# Altium schematic sheet FMC_DIO_32ch_lvds_a.SchDoc: FMC DIO LVDS 32
size 420 x 297 mm; Projet: FMC LVDS 32; CheckedBy: MK; Author: G.K.; CompanyName: CREOTECH; DrawnBy: G.K.; Organization: CTI SA; Address1: Creotech Instruments SA; Address2: Okulickiego 7/9, 05-500 Poland; DocumentNumber: 27; Revision: -; SheetNumber: 27; SheetTotal: 29; ModifiedBy: -; CreateDate: XX/XX/XXXX; CheckedDate: -; Title2: top; DivGrp: CTI; Designer: G.K.; ModifiedDate: -; ProjectName: FMC LVDS 32
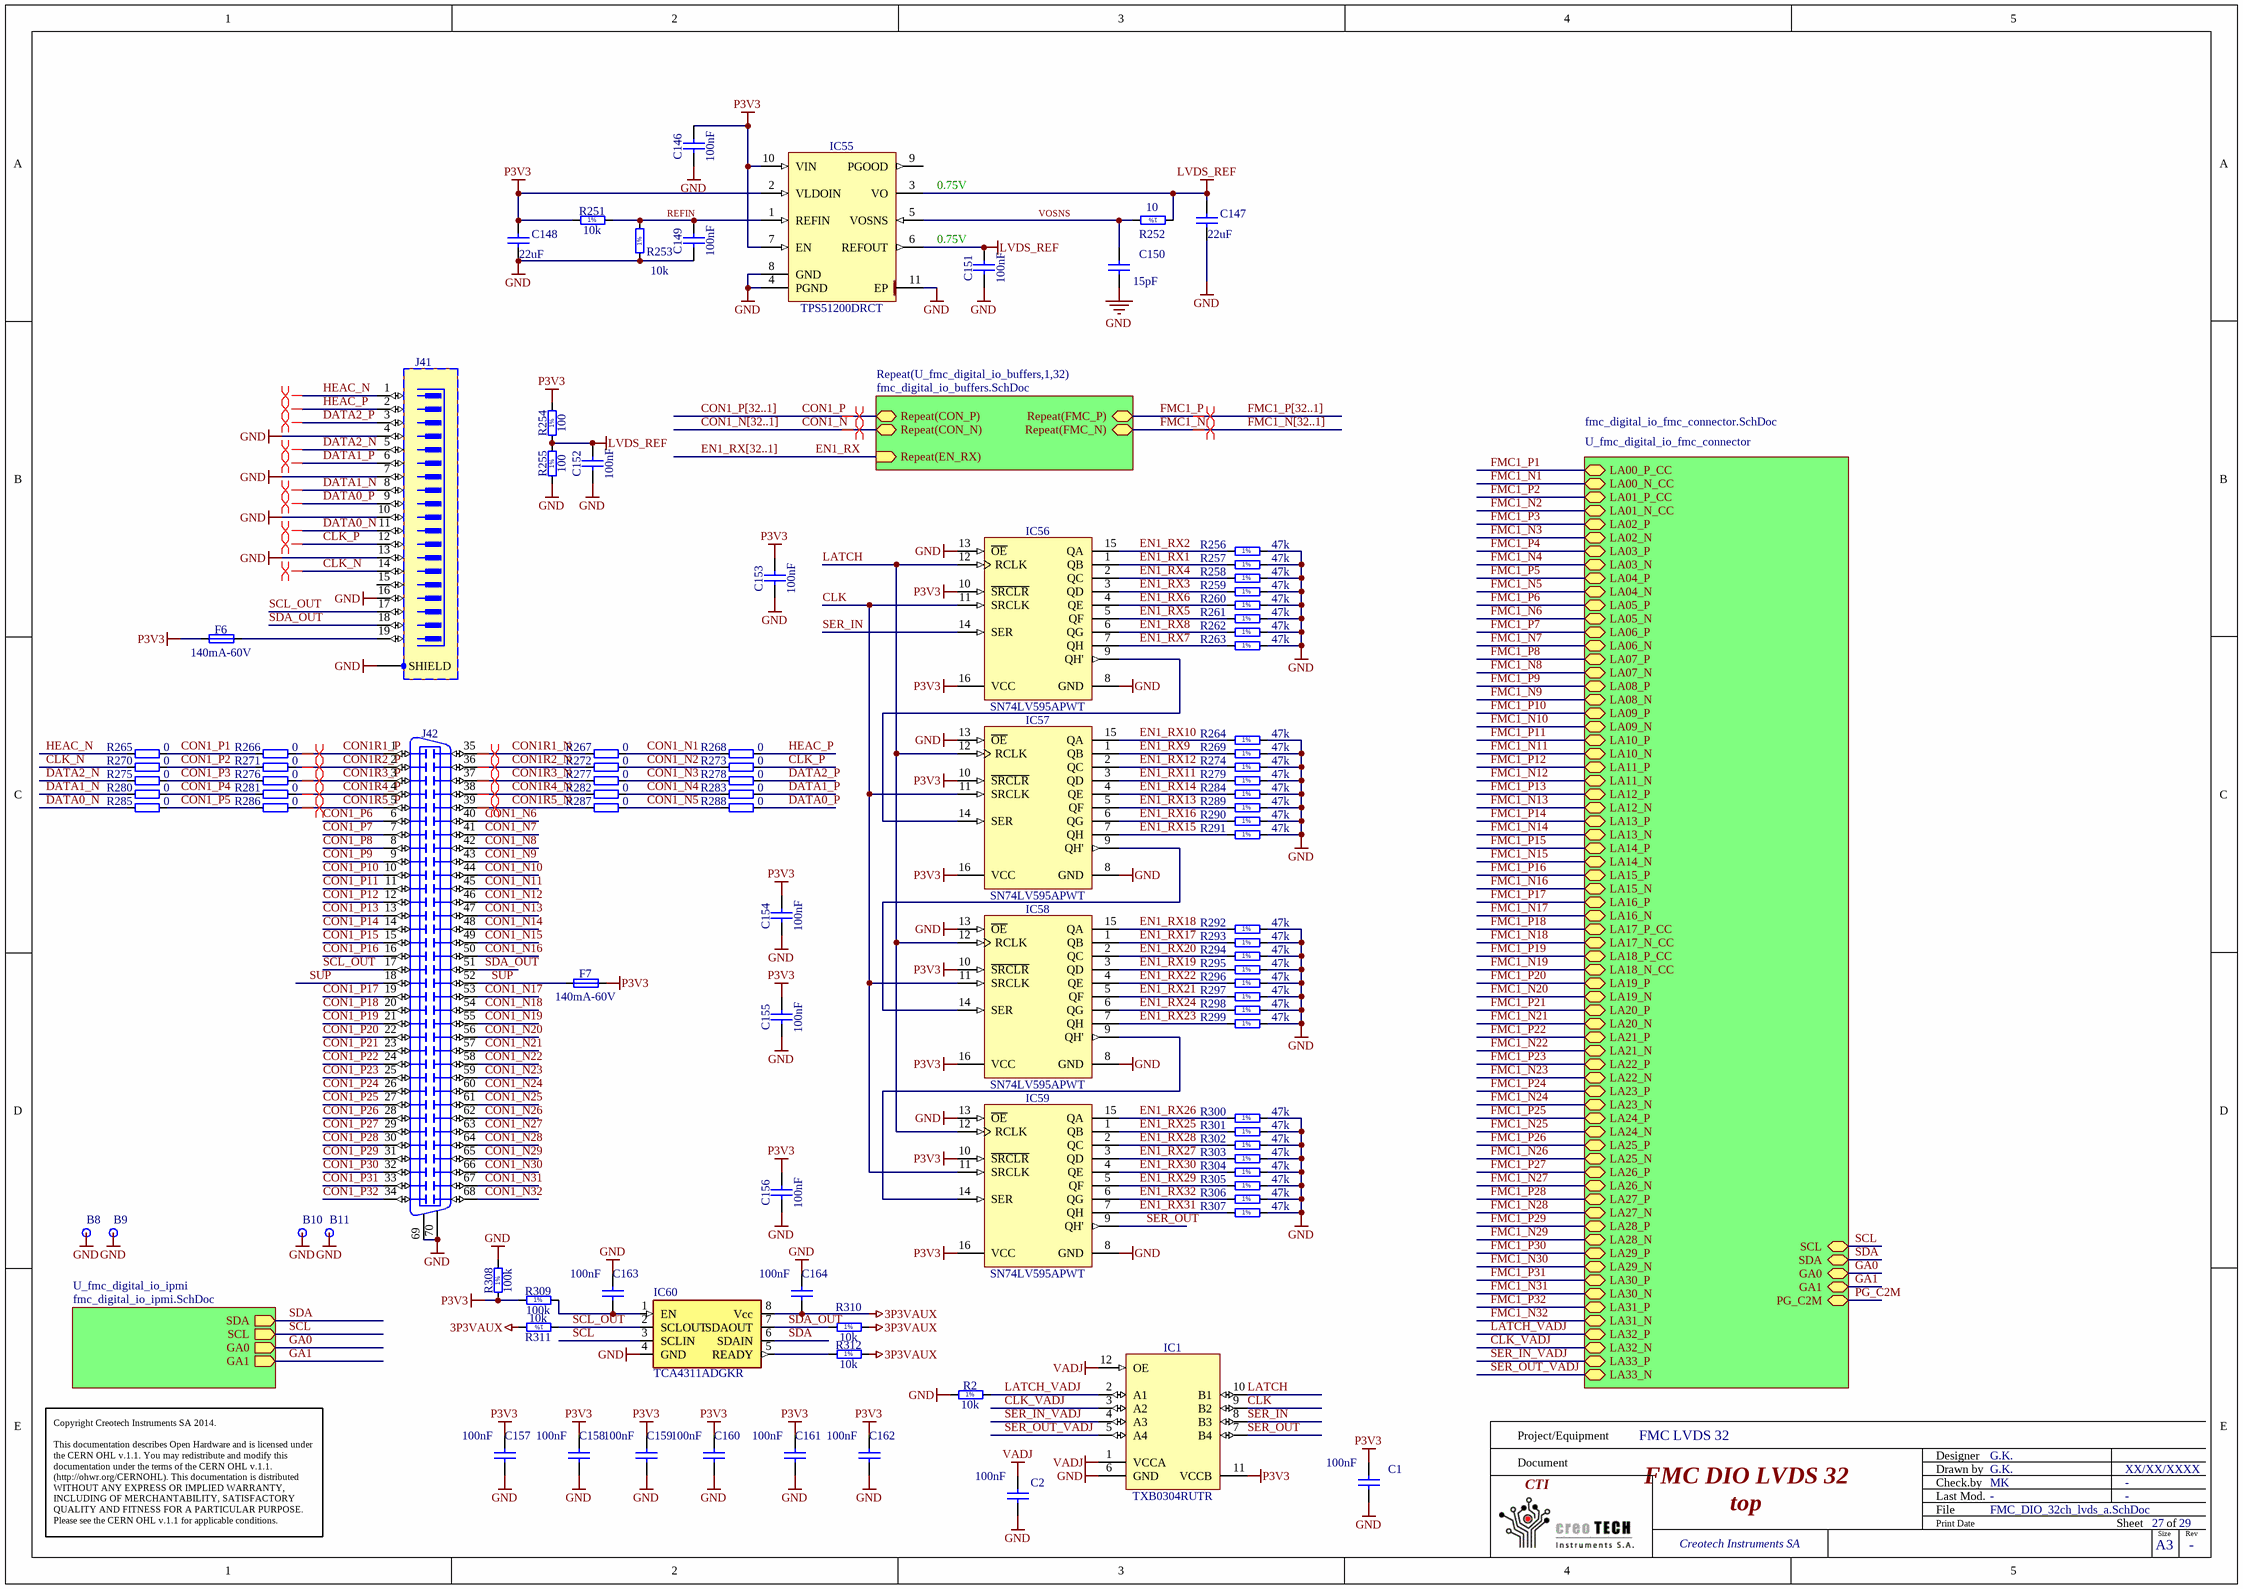
[diagram p0: FMC_DIO_32ch_lvds_a.SchDoc]

## Parts
B8  Plated Hole  [MTG300_600]  (value not drawn)
B9  Plated Hole  [MTG300_600]  (value not drawn)
B10  Plated Hole  [MTG300_600]  (value not drawn)
B11  Plated Hole  [MTG300_600]  (value not drawn)
C1  100nF  [CAPC1005X55N]
C2  100nF  [CAPC1005X55N]
C146  100nF  [CAPC1005X55N]
C147  22uF  [CAPC3216X180N]
C148  22uF  [CAPC3216X180N]
C149  100nF  [CAPC1005X55N]
C150  15pF  [CAPC1005X55N]
C151  100nF  [CAPC1005X55N]
C152  100nF  [CAPC1005X55N]
C153  100nF  [CAPC1005X55N]
C154  100nF  [CAPC1005X55N]
C155  100nF  [CAPC1005X55N]
C156  100nF  [CAPC1005X55N]
C157  100nF  [CAPC1005X55N]
C158  100nF  [CAPC1005X55N]
C159  100nF  [CAPC1005X55N]
C160  100nF  [CAPC1005X55N]
C161  100nF  [CAPC1005X55N]
C162  100nF  [CAPC1005X55N]
C163  100nF  [CAPC1005X55N]
C164  100nF  [CAPC1005X55N]
F6  140mA-60V  [FUSRC4632X90N]
F7  140mA-60V  [FUSRC4632X90N]
IC1  TXB0304RUTR  [TEXAS_RUT (R-PUQFN-N12)]
IC55  TPS51200DRCT  [TEXAS_DRC (S-PVSON-N10)]
IC56  SN74LV595APWT  [SOP65P640X120-16N]
IC57  SN74LV595APWT  [SOP65P640X120-16N]
IC58  SN74LV595APWT  [SOP65P640X120-16N]
IC59  SN74LV595APWT  [SOP65P640X120-16N]
IC60  TCA4311ADGKR  [msop-8]
J41  HDMI  [MOLEX_46765-1001]  (value not drawn)
J42  DNP  [MOLEX_71430-0013]  (value not drawn)
R2  10k  [RESC1005X40N]
R251  10k  [RESC1005X40N]
R252  10  [RESC1005X40N]
R253  10k  [RESC1005X40N]
R254  100  [RESC1005X40N]
R255  100  [RESC1005X40N]
R256  47k  [RESC1005X40N]
R257  47k  [RESC1005X40N]
R258  47k  [RESC1005X40N]
R259  47k  [RESC1005X40N]
R260  47k  [RESC1005X40N]
R261  47k  [RESC1005X40N]
R262  47k  [RESC1005X40N]
R263  47k  [RESC1005X40N]
R264  47k  [RESC1005X40N]
R265  0  [RESC1005X40N]
R266  0  [RESC1005X40N]
R267  0  [RESC1005X40N]
R268  0  [RESC1005X40N]
R269  47k  [RESC1005X40N]
R270  0  [RESC1005X40N]
R271  0  [RESC1005X40N]
R272  0  [RESC1005X40N]
R273  0  [RESC1005X40N]
R274  47k  [RESC1005X40N]
R275  0  [RESC1005X40N]
R276  0  [RESC1005X40N]
R277  0  [RESC1005X40N]
R278  0  [RESC1005X40N]
R279  47k  [RESC1005X40N]
R280  0  [RESC1005X40N]
R281  0  [RESC1005X40N]
R282  0  [RESC1005X40N]
R283  0  [RESC1005X40N]
R284  47k  [RESC1005X40N]
R285  0  [RESC1005X40N]
R286  0  [RESC1005X40N]
R287  0  [RESC1005X40N]
R288  0  [RESC1005X40N]
R289  47k  [RESC1005X40N]
R290  47k  [RESC1005X40N]
R291  47k  [RESC1005X40N]
R292  47k  [RESC1005X40N]
R293  47k  [RESC1005X40N]
R294  47k  [RESC1005X40N]
R295  47k  [RESC1005X40N]
R296  47k  [RESC1005X40N]
R297  47k  [RESC1005X40N]
R298  47k  [RESC1005X40N]
R299  47k  [RESC1005X40N]
R300  47k  [RESC1005X40N]
R301  47k  [RESC1005X40N]
R302  47k  [RESC1005X40N]
R303  47k  [RESC1005X40N]
R304  47k  [RESC1005X40N]
R305  47k  [RESC1005X40N]
R306  47k  [RESC1005X40N]
R307  47k  [RESC1005X40N]
R308  100k  [RESC1005X40N]
R309  100k  [RESC1005X40N]
R310  10k  [RESC1005X40N]
R311  10k  [RESC1005X40N]
R312  10k  [RESC1005X40N]

## Sub-sheets
Repeat(U_fmc_digital_io_buffers,1,32) = fmc_digital_io_buffers.SchDoc: Repeat(EN_RX) (in), Repeat(CON_P) (bidir), Repeat(CON_N) (bidir), Repeat(FMC_P) (bidir), Repeat(FMC_N) (bidir)
U_fmc_digital_io_fmc_connector = fmc_digital_io_fmc_connector.SchDoc: LA26_P (bidir), LA25_P (bidir), LA33_P (bidir), LA33_N (bidir), LA32_P (bidir), LA32_N (bidir), LA00_P_CC (bidir), LA00_N_CC (bidir), LA01_P_CC (bidir), LA01_N_CC (bidir), LA02_P (bidir), LA02_N (bidir), LA03_P (bidir), LA03_N (bidir), LA04_P (bidir), LA04_N (bidir), LA05_P (bidir), LA05_N (bidir), LA06_P (bidir), LA06_N (bidir), LA08_P (bidir), LA07_P (bidir), LA08_N (bidir), LA07_N (bidir), LA09_P (bidir), LA09_N (bidir), LA10_P (bidir), LA10_N (bidir), LA12_P (bidir), LA11_P (bidir), LA12_N (bidir), LA11_N (bidir), LA13_P (bidir), LA13_N (bidir), LA14_P (bidir), LA14_N (bidir), LA15_P (bidir), LA15_N (bidir), LA16_P (bidir), LA16_N (bidir), LA17_P_CC (bidir), LA17_N_CC (bidir), LA18_P_CC (bidir), LA18_N_CC (bidir), LA19_P (bidir), LA19_N (bidir), LA20_P (bidir), LA20_N (bidir), LA23_P (bidir), LA22_P (bidir), LA23_N (bidir), LA21_P (bidir), LA22_N (bidir), LA21_N (bidir), LA24_P (bidir), LA24_N (bidir), LA26_N (bidir), LA25_N (bidir), LA27_P (bidir), LA27_N (bidir), SCL (bidir), SDA (bidir), GA0 (bidir), GA1 (bidir), PG_C2M (bidir), LA28_P (bidir), LA28_N (bidir), LA29_P (bidir), LA29_N (bidir), LA30_P (bidir), LA30_N (bidir), LA31_P (bidir), LA31_N (bidir)
U_fmc_digital_io_ipmi = fmc_digital_io_ipmi.SchDoc: SDA (out), SCL (out), GA0 (out), GA1 (out)

## Nets
3P3VAUX: C164.2 IC60.8(Vcc) R310.2 R311.2 R312.2
GND: B8.1 B9.1 B10.1 B11.1 C1.2 C2.2 C146.1 C147.1 C148.1 C149.1 C150.2 C151.1 C152.1 C153.1 C154.1 C155.1 C156.1 C157.2 C158.2 C159.2 C160.2 C161.2 C162.2 C163.1 C164.1 IC1.6(GND) IC55.4(PGND) IC55.8(GND) IC55.11(EP) IC56.8(GND) IC56.13(~{OE}) IC57.8(GND) IC57.13(~{OE}) IC58.8(GND) IC58.13(~{OE}) IC59.8(GND) IC59.13(~{OE}) IC60.4(GND) J41.4 J41.7 J41.10 J41.13 J41.16 J41.SHIELD J42.69 J42.70 R2.1 R253.1 R255.1 R256.2 R257.2 R258.2 R259.2 R260.2 R261.2 R262.2 R263.2 R264.2 R269.2 R274.2 R279.2 R284.2 R289.2 R290.2 R291.2 R292.2 R293.2 R294.2 R295.2 R296.2 R297.2 R298.2 R299.2 R300.2 R301.2 R302.2 R303.2 R304.2 R305.2 R306.2 R307.2 R308.2
LVDS_REF: C147.2 C151.2 C152.2 IC55.3(VO) IC55.6(REFOUT) R252.1 R254.1 R255.2
P3V3: C1.1 C146.2 C148.2 C153.2 C154.2 C155.2 C156.2 C157.1 C158.1 C159.1 C160.1 C161.1 C162.1 F6.1 F7.2 IC1.11(VCCB) IC55.2(VLDOIN) IC55.7(EN) IC55.10(VIN) IC56.10(~{SRCLR}) IC56.16(VCC) IC57.10(~{SRCLR}) IC57.16(VCC) IC58.10(~{SRCLR}) IC58.16(VCC) IC59.10(~{SRCLR}) IC59.16(VCC) R251.1 R254.2 R308.1 R309.1
VADJ: C2.1 IC1.1(VCCA) IC1.12(OE)
CLK: IC1.9(B2) IC56.11(SRCLK) IC57.11(SRCLK) IC58.11(SRCLK) IC59.11(SRCLK)
CLK_N: J41.14 R270.1
CLK_P: J41.12 R273.2
CLK_VADJ: IC1.3(A2) ; sheet U_fmc_digital_io_fmc_connector/LA32_N
CON1_N: sheet Repeat(U_fmc_digital_io_buffers,1,32)/Repeat(CON_N)
CON1_N1: R267.2 R268.1
CON1_N2: R272.2 R273.1
CON1_N3: R277.2 R278.1
CON1_N4: R282.2 R283.1
CON1_N5: R287.2 R288.1
CON1_N6: J42.40
CON1_N7: J42.41
CON1_N8: J42.42
CON1_N9: J42.43
CON1_N10: J42.44
CON1_N11: J42.45
CON1_N12: J42.46
CON1_N13: J42.47
CON1_N14: J42.48
CON1_N15: J42.49
CON1_N16: J42.50
CON1_N17: J42.53
CON1_N18: J42.54
CON1_N19: J42.55
CON1_N20: J42.56
CON1_N21: J42.57
CON1_N22: J42.58
CON1_N23: J42.59
CON1_N24: J42.60
CON1_N25: J42.61
CON1_N26: J42.62
CON1_N27: J42.63
CON1_N28: J42.64
CON1_N29: J42.65
CON1_N30: J42.66
CON1_N31: J42.67
CON1_N32: J42.68
CON1_P: sheet Repeat(U_fmc_digital_io_buffers,1,32)/Repeat(CON_P)
CON1_P1: R265.2 R266.1
CON1_P2: R270.2 R271.1
CON1_P3: R275.2 R276.1
CON1_P4: R280.2 R281.1
CON1_P5: R285.2 R286.1
CON1_P6: J42.6
CON1_P7: J42.7
CON1_P8: J42.8
CON1_P9: J42.9
CON1_P10: J42.10
CON1_P11: J42.11
CON1_P12: J42.12
CON1_P13: J42.13
CON1_P14: J42.14
CON1_P15: J42.15
CON1_P16: J42.16
CON1_P17: J42.19
CON1_P18: J42.20
CON1_P19: J42.21
CON1_P20: J42.22
CON1_P21: J42.23
CON1_P22: J42.24
CON1_P23: J42.25
CON1_P24: J42.26
CON1_P25: J42.27
CON1_P26: J42.28
CON1_P27: J42.29
CON1_P28: J42.30
CON1_P29: J42.31
CON1_P30: J42.32
CON1_P31: J42.33
CON1_P32: J42.34
CON1R1_N: J42.35 R267.1
CON1R1_P: J42.1 R266.2
CON1R2_N: J42.36 R272.1
CON1R2_P: J42.2 R271.2
CON1R3_N: J42.37 R277.1
CON1R3_P: J42.3 R276.2
CON1R4_N: J42.38 R282.1
CON1R4_P: J42.4 R281.2
CON1R5_N: J42.39 R287.1
CON1R5_P: J42.5 R286.2
DATA0_N: J41.11 R285.1
DATA0_P: J41.9 R288.2
DATA1_N: J41.8 R280.1
DATA1_P: J41.6 R283.2
DATA2_N: J41.5 R275.1
DATA2_P: J41.3 R278.2
EN1_RX: sheet Repeat(U_fmc_digital_io_buffers,1,32)/Repeat(EN_RX)
EN1_RX1: IC56.1(QB) R257.1
EN1_RX2: IC56.15(QA) R256.1
EN1_RX3: IC56.3(QD) R259.1
EN1_RX4: IC56.2(QC) R258.1
EN1_RX5: IC56.5(QF) R261.1
EN1_RX6: IC56.4(QE) R260.1
EN1_RX7: IC56.7(QH) R263.1
EN1_RX8: IC56.6(QG) R262.1
EN1_RX9: IC57.1(QB) R269.1
EN1_RX10: IC57.15(QA) R264.1
EN1_RX11: IC57.3(QD) R279.1
EN1_RX12: IC57.2(QC) R274.1
EN1_RX13: IC57.5(QF) R289.1
EN1_RX14: IC57.4(QE) R284.1
EN1_RX15: IC57.7(QH) R291.1
EN1_RX16: IC57.6(QG) R290.1
EN1_RX17: IC58.1(QB) R293.1
EN1_RX18: IC58.15(QA) R292.1
EN1_RX19: IC58.3(QD) R295.1
EN1_RX20: IC58.2(QC) R294.1
EN1_RX21: IC58.5(QF) R297.1
EN1_RX22: IC58.4(QE) R296.1
EN1_RX23: IC58.7(QH) R299.1
EN1_RX24: IC58.6(QG) R298.1
EN1_RX25: IC59.1(QB) R301.1
EN1_RX26: IC59.15(QA) R300.1
EN1_RX27: IC59.3(QD) R303.1
EN1_RX28: IC59.2(QC) R302.1
EN1_RX29: IC59.5(QF) R305.1
EN1_RX30: IC59.4(QE) R304.1
EN1_RX31: IC59.7(QH) R307.1
EN1_RX32: IC59.6(QG) R306.1
FMC1_N: sheet Repeat(U_fmc_digital_io_buffers,1,32)/Repeat(FMC_N)
FMC1_N1: sheet U_fmc_digital_io_fmc_connector/LA00_N_CC
FMC1_N2: sheet U_fmc_digital_io_fmc_connector/LA01_N_CC
FMC1_N3: sheet U_fmc_digital_io_fmc_connector/LA02_N
FMC1_N4: sheet U_fmc_digital_io_fmc_connector/LA03_N
FMC1_N5: sheet U_fmc_digital_io_fmc_connector/LA04_N
FMC1_N6: sheet U_fmc_digital_io_fmc_connector/LA05_N
FMC1_N7: sheet U_fmc_digital_io_fmc_connector/LA06_N
FMC1_N8: sheet U_fmc_digital_io_fmc_connector/LA07_N
FMC1_N9: sheet U_fmc_digital_io_fmc_connector/LA08_N
FMC1_N10: sheet U_fmc_digital_io_fmc_connector/LA09_N
FMC1_N11: sheet U_fmc_digital_io_fmc_connector/LA10_N
FMC1_N12: sheet U_fmc_digital_io_fmc_connector/LA11_N
FMC1_N13: sheet U_fmc_digital_io_fmc_connector/LA12_N
FMC1_N14: sheet U_fmc_digital_io_fmc_connector/LA13_N
FMC1_N15: sheet U_fmc_digital_io_fmc_connector/LA14_N
FMC1_N16: sheet U_fmc_digital_io_fmc_connector/LA15_N
FMC1_N17: sheet U_fmc_digital_io_fmc_connector/LA16_N
FMC1_N18: sheet U_fmc_digital_io_fmc_connector/LA17_N_CC
FMC1_N19: sheet U_fmc_digital_io_fmc_connector/LA18_N_CC
FMC1_N20: sheet U_fmc_digital_io_fmc_connector/LA19_N
FMC1_N21: sheet U_fmc_digital_io_fmc_connector/LA20_N
FMC1_N22: sheet U_fmc_digital_io_fmc_connector/LA21_N
FMC1_N23: sheet U_fmc_digital_io_fmc_connector/LA22_N
FMC1_N24: sheet U_fmc_digital_io_fmc_connector/LA23_N
FMC1_N25: sheet U_fmc_digital_io_fmc_connector/LA24_N
FMC1_N26: sheet U_fmc_digital_io_fmc_connector/LA25_N
FMC1_N27: sheet U_fmc_digital_io_fmc_connector/LA26_N
FMC1_N28: sheet U_fmc_digital_io_fmc_connector/LA27_N
FMC1_N29: sheet U_fmc_digital_io_fmc_connector/LA28_N
FMC1_N30: sheet U_fmc_digital_io_fmc_connector/LA29_N
FMC1_N31: sheet U_fmc_digital_io_fmc_connector/LA30_N
FMC1_N32: sheet U_fmc_digital_io_fmc_connector/LA31_N
FMC1_P: sheet Repeat(U_fmc_digital_io_buffers,1,32)/Repeat(FMC_P)
FMC1_P1: sheet U_fmc_digital_io_fmc_connector/LA00_P_CC
FMC1_P2: sheet U_fmc_digital_io_fmc_connector/LA01_P_CC
FMC1_P3: sheet U_fmc_digital_io_fmc_connector/LA02_P
FMC1_P4: sheet U_fmc_digital_io_fmc_connector/LA03_P
FMC1_P5: sheet U_fmc_digital_io_fmc_connector/LA04_P
FMC1_P6: sheet U_fmc_digital_io_fmc_connector/LA05_P
FMC1_P7: sheet U_fmc_digital_io_fmc_connector/LA06_P
FMC1_P8: sheet U_fmc_digital_io_fmc_connector/LA07_P
FMC1_P9: sheet U_fmc_digital_io_fmc_connector/LA08_P
FMC1_P10: sheet U_fmc_digital_io_fmc_connector/LA09_P
FMC1_P11: sheet U_fmc_digital_io_fmc_connector/LA10_P
FMC1_P12: sheet U_fmc_digital_io_fmc_connector/LA11_P
FMC1_P13: sheet U_fmc_digital_io_fmc_connector/LA12_P
FMC1_P14: sheet U_fmc_digital_io_fmc_connector/LA13_P
FMC1_P15: sheet U_fmc_digital_io_fmc_connector/LA14_P
FMC1_P16: sheet U_fmc_digital_io_fmc_connector/LA15_P
FMC1_P17: sheet U_fmc_digital_io_fmc_connector/LA16_P
FMC1_P18: sheet U_fmc_digital_io_fmc_connector/LA17_P_CC
FMC1_P19: sheet U_fmc_digital_io_fmc_connector/LA18_P_CC
FMC1_P20: sheet U_fmc_digital_io_fmc_connector/LA19_P
FMC1_P21: sheet U_fmc_digital_io_fmc_connector/LA20_P
FMC1_P22: sheet U_fmc_digital_io_fmc_connector/LA21_P
FMC1_P23: sheet U_fmc_digital_io_fmc_connector/LA22_P
FMC1_P24: sheet U_fmc_digital_io_fmc_connector/LA23_P
FMC1_P25: sheet U_fmc_digital_io_fmc_connector/LA24_P
FMC1_P26: sheet U_fmc_digital_io_fmc_connector/LA25_P
FMC1_P27: sheet U_fmc_digital_io_fmc_connector/LA26_P
FMC1_P28: sheet U_fmc_digital_io_fmc_connector/LA27_P
FMC1_P29: sheet U_fmc_digital_io_fmc_connector/LA28_P
FMC1_P30: sheet U_fmc_digital_io_fmc_connector/LA29_P
FMC1_P31: sheet U_fmc_digital_io_fmc_connector/LA30_P
FMC1_P32: sheet U_fmc_digital_io_fmc_connector/LA31_P
GA0: sheet U_fmc_digital_io_ipmi/GA0, sheet U_fmc_digital_io_fmc_connector/GA0
GA1: sheet U_fmc_digital_io_ipmi/GA1, sheet U_fmc_digital_io_fmc_connector/GA1
HEAC_N: J41.1 R265.1
HEAC_P: J41.2 R268.2
LATCH: IC1.10(B1) IC56.12(RCLK) IC57.12(RCLK) IC58.12(RCLK) IC59.12(RCLK)
LATCH_VADJ: IC1.2(A1) R2.2 ; sheet U_fmc_digital_io_fmc_connector/LA32_P
PG_C2M: sheet U_fmc_digital_io_fmc_connector/PG_C2M
REFIN: C149.2 IC55.1(REFIN) R251.2 R253.2
SCL: IC60.3(SCLIN) ; sheet U_fmc_digital_io_ipmi/SCL, sheet U_fmc_digital_io_fmc_connector/SCL
SCL_OUT: IC60.2(SCLOUT) J41.17 J42.17 R311.1
SDA: IC60.6(SDAIN) ; sheet U_fmc_digital_io_ipmi/SDA, sheet U_fmc_digital_io_fmc_connector/SDA
SDA_OUT: IC60.7(SDAOUT) J41.18 J42.51 R310.1
SER_IN: IC1.8(B3) IC56.14(SER)
SER_IN_VADJ: IC1.4(A3) ; sheet U_fmc_digital_io_fmc_connector/LA33_P
SER_OUT: IC1.7(B4) IC59.9(QH')
SER_OUT_VADJ: IC1.5(A4) ; sheet U_fmc_digital_io_fmc_connector/LA33_N
SUP: F7.1 J42.18 J42.52
VOSNS: C150.1 IC55.5(VOSNS) R252.2
NetC163_2: C163.2 IC60.1(EN) R309.2
NetF6_2: F6.2 J41.19
NetIC56_9: IC56.9(QH') IC57.14(SER)
NetIC57_9: IC57.9(QH') IC58.14(SER)
NetIC58_9: IC58.9(QH') IC59.14(SER)
NetIC60_5: IC60.5(READY) R312.1

Not connected (* = marked no-connect by the designer): IC55 9(PGOOD); J41 15

## Buses and harness runs
bus CON1_N[32..1]
bus CON1_P[32..1]
bus EN1_RX[32..1]
bus FMC1_N[32..1]
bus FMC1_P[32..1]

## Layout directives
differential pair: CLK_N, CLK_P, CON1_N, CON1_P, CON1R1_N, CON1R1_P, CON1R2_N, CON1R2_P, CON1R3_N, CON1R3_P, CON1R4_N, CON1R4_P, CON1R5_N, CON1R5_P, DATA0_N, DATA0_P, DATA1_N, DATA1_P, DATA2_N, DATA2_P, FMC1_N, FMC1_P, HEAC_N, HEAC_P

## Notes on the sheet
- (near IC55) 0.75V
- (near C151) 0.75V
- Project/Equipment
- Document
- Designer
- Drawn by
- Check.by
- Copyright Creotech Instruments SA 2014.
  This documentation describes Open Hardware and is licensed under the CERN OHL v.1.1. You may redistribute and modify this documentation under the terms of the CERN OHL v.1.1. (http://ohwr.org/CERNOHL). This documentation is distributed WITHOUT ANY EXPRESS OR IMPLIED WARRANTY, INCLUDING OF MERCHANTABILITY, SATISFACTORY QUALITY AND FITNESS FOR A PARTICULAR PURPOSE. Please see the CERN OHL v.1.1 for applicable conditions.
- File
- Last Mod.
- Print Date
- Sheet
- Size
- A3
- of
- Rev
- (in symbol R0402_10K_1%_0.0625W_100PPM) 1%
- (in symbol R0402_10R_1%_0.0625W_200PPM) 1%
- (in symbol R0402_47K_1%_0.0625W_100PPM) 1%
- (in symbol R0402_100K_1%_0.0625W_100PPM) 1%
- (in symbol R0402_100R_1%_0.0625W_100PPM) 1%

## Library data of the parts
B8-B11 = PLATED_HOLE3.0_PAD6.0: Single Terminal Socket; Part Description: Plated Through Hole: Hole Dia.=3.0mm Pad Dia.=6.0mm; Mounted: No; Table: Pads; Part Number: PLATED_HOLE3.0_PAD6.0; Component Kind: Standard (No BOM); Component Type: Standard (No BOM); Designator: Single Terminal Socket; Library Reference: Single Terminal Socket; Pin Count: 1; Family: Plated Hole; Socket: No; SMD: No; Status: None; ComponentHeight: 0mm; Author: CERN DEM JLC; CreateDate: 26.05.2008; LatestRevisionDate: 26.05.2008; PackageDescription: Plated Through Hole: Hole Dia.=3.0mm Pad Dia.=6.0mm
C1 C2 C157-C164 = CC0402_100NF_16V_10%_X7R: Non-polarised capacitor; Part Description: SMD Multilayer Chip Ceramic Capacitor; Manufacturer: GENERIC; Manufacturer1 Part Number: GRM155R71C104KA88D; Voltage: 16V; TC: X7R; Tolerance: ±10%; Table: Capacitors SMD; Part Number: CC0402_100NF_16V_10%_X7R; Component Kind: Standard; Component Type: Standard; Pin Count: 2; Value: 100nF; Status: Not Recommended; Manufacturer Part Number: CC0402_100NF_16V_10%_X7R; Case: 0402; Mounted: Yes; Socket: No; SMD: Yes; Manufacturer1 Example: MURATA; Manufacturer1 ComponentHeight: 0.55mm; HelpURL: \\cern.ch\dfs\Applications\Altium\Datasheets\CC0402_X7R_MURATA_GRM.pdf; Author: CERN DEM JLC; CreateDate: 2013-12-05; LatestRevisionDate: 2007-12-03
C146 C149 C151-C156 = CC0402_100NF_16V_10%_X5R: Non-polarised capacitor; Part Description: SMD Multilayer Chip Ceramic Capacitor; Manufacturer: GENERIC; Manufacturer1 Part Number: GRM155R61C104KA88D; Voltage: 16V; TC: X5R; Tolerance: ±10%; Table: Capacitors SMD; Part Number: CC0402_100NF_16V_10%_X5R; Component Kind: Standard; Component Type: Standard; Pin Count: 2; Value: 100nF; Status: None; Manufacturer Part Number: CC0402_100NF_16V_10%_X5R; Case: 0402; Mounted: Yes; Socket: No; SMD: Yes; Manufacturer1 Example: MURATA; Manufacturer1 ComponentHeight: 0.55mm; HelpURL: \\cern.ch\dfs\Applications\Altium\Datasheets\CC0402_X5R_MURATA_GRM.pdf; Author: CERN DEM JLC; CreateDate: 2013-12-10; LatestRevisionDate: 2013-12-10
C147 C148 = CC1206_22UF_10V_10%_X7R: Non-polarised capacitor; Part Description: SMD Multilayer Chip Ceramic Capacitor; Manufacturer: GENERIC; Manufacturer1 Part Number: GRM31CR71A226KE15L; Voltage: 10V; TC: X7R; Tolerance: ±10%; Table: Capacitors SMD; Part Number: CC1206_22UF_10V_10%_X7R; Component Kind: Standard; Component Type: Standard; Pin Count: 2; Value: 22uF; Status: Preferred; Manufacturer Part Number: CC1206_22UF_10V_10%_X7R; Case: 1206; Mounted: Yes; Socket: No; SMD: Yes; Manufacturer1 Example: MURATA; Manufacturer1 ComponentHeight: 1.8mm; HelpURL: \\cern.ch\dfs\Applications\Altium\Datasheets\CC1206_X7R_MURATA_GRM-HI-CAP.pdf; Author: CERN DEM JLC; CreateDate: 2010-06-08; LatestRevisionDate: 2010-06-08
C150 = CC0402_15PF_50V_5%_NP0: Non-polarised capacitor; Part Description: SMD Multilayer Chip Ceramic Capacitor; Manufacturer: GENERIC; Manufacturer1 Part Number: 223886915159; Voltage: 50V; TC: NP0; Tolerance: ±5%; Table: Capacitors SMD; Part Number: CC0402_15PF_50V_5%_NP0; Component Kind: Standard; Component Type: Standard; Pin Count: 2; Value: 15pF; Status: Not Recommended; Manufacturer Part Number: CC0402_15PF_50V_5%_NP0; Case: 0402; Mounted: Yes; Socket: No; SMD: Yes; Manufacturer1 Example: PHYCOMP; Manufacturer1 ComponentHeight: 0.55mm; HelpURL: \\cern.ch\dfs\Applications\Altium\Datasheets\CC0402_NP0_PHYCOMP.pdf; Author: CERN DEM JLC; CreateDate: 2007-12-03; LatestRevisionDate: 2007-12-03
F6 F7 = FUSR1812_TYCO-MINISMDC014F: Fuse; Part Description: PolySwitch® PTC Overcurrent Protection Device; Manufacturer: TYCO ELECTRONICS; PressFit: No; Table: Fuses; Part Number: FUSR1812_TYCO-MINISMDC014F; Component Kind: Standard; Component Type: Standard; Pin Count: 2; PackageDescription: Chip Resettable Fuse, 2-Leads, Body 4.6x3.2mm, IPC Medium Density; Family: Fuses Resettable; Mounted: Yes; Socket: No; SMD: Yes; Value: 140mA-60V; Manufacturer Part Number: miniSMDC014F; ComponentHeight: 0.89mm; HelpURL: \\cern.ch\dfs\Applications\Altium\Datasheets\FUSR_TYCO_MiniSMDC014F.pdf; Author: CERN DEM JLC; CreateDate: 2008-07-02; LatestRevisionDate: 2012-10-10
IC1 = TXB0304RUTR: 4-bit Bidirectional Auto-direction Sensing Translator with Fully Symmetric 0.9V to 3.6V Range; Manufacturer: TEXAS INSTRUMENTS; PressFit: No; Bonding: No; Part Number: TXB0304RUTR; Component Kind: Standard; Component Type: Standard; Device: TXB0304RUTR; PackageDescription: SON, TEXAS RUT (R-PUQFN-N12), 0.50mm Pitch, 12-pin, 1.70mm W  X 2.00mm L X 0.55mm Height; Part Description: 4-bit Bidirectional Auto-direction Sensing Translator with Fully Symmetric 0.9V to 3.6V Range; Manufacturer Part Number: TXB0304RUTR; Pin Count: 12; Case: QFN12; Mounted: Yes; Socket: No; SMD: Yes; Sense: No; ComponentHeight: 0.55mm; Author: CERN DEM JLC; HelpURL: \\cern.ch\dfs\Applications\Altium\Datasheets\TXB0304RUTR.pdf; CreateDate: 27.10.2014; LatestRevisionDate: 28.10.2014
IC55 = TPS51200DRCT: Sink/Source DDR Termination Regulator; Part Description: 3.3V Sink/Source DDR Termination Regulator; Manufacturer: TEXAS INSTRUMENTS; PressFit: No; Bonding: No; Table: Regulators; Part Number: TPS51200DRCT; Component Kind: Standard; Component Type: Standard; Device: TPS51200DRCT; PackageDescription: SON, 0.50mm Pitch, 10-pin, 3.00mm W  X 3.00mm L X 1.00mm Height, (w/thermal tab 1.75 X 2.50 mm); Manufacturer Part Number: TPS51200DRCT; Pin Count: 11; Case: SON10; Mounted: Yes; Socket: No; SMD: Yes; ComponentHeight: 1mm; HelpURL: \\cern.ch\dfs\Applications\Altium\Datasheets\TPS51200DRCT.pdf; Author: CERN DEM JLC; CreateDate: 2010-02-03; LatestRevisionDate: 2013-11-06
IC56-IC59 = SN74LV595APWT: 8-Bit Shift Register With 3-State Output Register; Manufacturer: TEXAS INSTRUMENTS; PressFit: No; Bonding: No; Table: Standard Logic; Part Number: SN74LV595APWT; Component Kind: Standard; Component Type: Standard; Device: SN74LV595APWT; PackageDescription: SOP, 0.65mm pitch; 16 pin, 4.40mm W X 5.00mm L X 1.20mm H body IPC Medium Density; Part Description: 8-Bit Shift Register With 3-State Output Register; Manufacturer Part Number: SN74LV595APWT; Pin Count: 16; Case: TSSOP16; Mounted: Yes; Socket: No; SMD: Yes; ComponentHeight: 1.2mm; Author: CERN DEM JLC; HelpURL: \\cern.ch\dfs\Applications\Altium\Datasheets\SN74LV595APWT.pdf; CreateDate: 2012-05-10; LatestRevisionDate: 2012-05-10
IC60 = IIC_TCA4311A: HOT SWAPPABLE 2-WIRE BUS BUFFERS
J41 = MOLEX_46765-1001: Connector HDMI 19 Male + 1 Shield; Part Description: 0.4mm Pitch, Surface Mount Right Angle 19 Contacts Micro HDMI Type-D Receptacle With Kapton Tape  And Thru Hole Mounting Pads; Manufacturer: MOLEX; Mounted: No; PressFit: No; Part Number: MOLEX_46765-1001; Component Kind: Standard; Component Type: Standard; Pin Count: 20; Family: HDMI; Socket: No; SMD: Yes; Status: None; Manufacturer Part Number: 46765-1001; ComponentHeight: 2.9mm; HelpURL: \\cern.ch\dfs\Applications\Altium\Datasheets\MOLEX_46765-1001.pdf; Author: CERN DEM JLC; CreateDate: 2011-09-26; LatestRevisionDate: 2011-09-26; Table: MOLEX
J42 = MOLEX_71430-0013: Very High Density Cable Interconnect (VHDCI ) 68 Female; Part Description: 68 Positions, Pitch 0.8mm, Very Hight Density Right Angle Receptacle, VHDCI Standard (Recommended PCB Thickness: 1.6mm); Manufacturer: MOLEX; PressFit: No; Part Number: MOLEX_71430-0013; Component Kind: Standard; Component Type: Standard; Pin Count: 70; Family: VHDCI; Mounted: Yes; Socket: No; SMD: No; Status: None; Manufacturer Part Number: 71430-0013; ComponentHeight: 6.28mm; HelpURL: \\cern.ch\dfs\Applications\Altium\Datasheets\MOLEX_71430-0013.pdf; Author: CERN DEM JLC; CreateDate: 2014-01-30; LatestRevisionDate: 2014-01-30; Table: MOLEX
R2 R251 R253 R310-R312 = R0402_10K_1%_0.0625W_100PPM: Resistor - 1%; Part Description: General Purpose Thick Film Chip Resistor; Manufacturer: GENERIC; Manufacturer1 Part Number: 232270671003L; TC: ±100ppm/°C; Table: Resistors SMD; Part Number: R0402_10K_1%_0.0625W_100PPM; Component Kind: Standard; Component Type: Standard; Pin Count: 2; Value: 10k; Status: Not recommended; Power: 0.0625W; Tolerance: ±1%; Manufacturer Part Number: R0402_10K_1%_0.0625W_100PPM; Case: 0402; Mounted: Yes; Socket: No; SMD: Yes; Manufacturer1 Example: YAGEO PHYCOMP; Manufacturer1 ComponentHeight: 0.4mm; HelpURL: \\cern.ch\dfs\Applications\Altium\Datasheets\R0402_Phycomp_RC0402.pdf; Author: CERN DEM JLC; CreateDate: 2007-12-03; LatestRevisionDate: 2012-10-17
R252 = R0402_10R_1%_0.0625W_200PPM: Resistor - 1%; Part Description: General Purpose Thick Film Chip Resistor; Manufacturer: GENERIC; Manufacturer1 Part Number: 232270671009L; TC: ±200ppm/°C; Table: Resistors SMD; Part Number: R0402_10R_1%_0.0625W_200PPM; Component Kind: Standard; Component Type: Standard; Pin Count: 2; Value: 10; Status: Not recommended; Power: 0.0625W; Tolerance: ±1%; Manufacturer Part Number: R0402_10R_1%_0.0625W_200PPM; Case: 0402; Mounted: Yes; Socket: No; SMD: Yes; Manufacturer1 Example: YAGEO PHYCOMP; Manufacturer1 ComponentHeight: 0.4mm; HelpURL: \\cern.ch\dfs\Applications\Altium\Datasheets\R0402_Phycomp_RC0402.pdf; Author: CERN DEM JLC; CreateDate: 2009-06-24; LatestRevisionDate: 2012-10-17
R254 R255 = R0402_100R_1%_0.0625W_100PPM: Resistor - 1%; Part Description: General Purpose Thick Film Chip Resistor; Manufacturer: GENERIC; Manufacturer1 Part Number: 232270671001L; TC: ±100ppm/°C; Table: Resistors SMD; Part Number: R0402_100R_1%_0.0625W_100PPM; Component Kind: Standard; Component Type: Standard; Pin Count: 2; Value: 100; Status: Not recommended; Power: 0.0625W; Tolerance: ±1%; Manufacturer Part Number: R0402_100R_1%_0.0625W_100PPM; Case: 0402; Mounted: Yes; Socket: No; SMD: Yes; Manufacturer1 Example: YAGEO PHYCOMP; Manufacturer1 ComponentHeight: 0.4mm; HelpURL: \\cern.ch\dfs\Applications\Altium\Datasheets\R0402_Phycomp_RC0402.pdf; Author: CERN DEM JLC; CreateDate: 2007-12-03; LatestRevisionDate: 2012-10-17
R256-R264 R269 R274 R279 R284 R289-R307 = R0402_47K_1%_0.0625W_100PPM: Resistor - 1%; Part Description: General Purpose Thick Film Chip Resistor; Manufacturer: GENERIC; Manufacturer1 Part Number: 232270675103L; TC: ±100ppm/°C; Table: Resistors SMD; Part Number: R0402_47K_1%_0.0625W_100PPM; Component Kind: Standard; Component Type: Standard; Pin Count: 2; Value: 47k; Status: Not recommended; Power: 0.0625W; Tolerance: ±1%; Manufacturer Part Number: R0402_47K_1%_0.0625W_100PPM; Case: 0402; Mounted: Yes; Socket: No; SMD: Yes; Manufacturer1 Example: YAGEO PHYCOMP; Manufacturer1 ComponentHeight: 0.4mm; HelpURL: \\cern.ch\dfs\Applications\Altium\Datasheets\R0402_Phycomp_RC0402.pdf; Author: CERN DEM JLC; CreateDate: 2007-12-03; LatestRevisionDate: 2012-10-17
R265-R268 R270-R273 R275-R278 R280-R283 R285-R288 = R0402_0R_JUMPER: Resistor; Part Description: 1A (0.05R Max DC Resistance) Zero Ohm Jumper; Manufacturer: GENERIC; Manufacturer1 Part Number: 232270591001L; Table: Resistors SMD; Part Number: R0402_0R_JUMPER; Component Kind: Standard; Component Type: Standard; Pin Count: 2; Value: 0; Status: Not recommended; Manufacturer Part Number: R0402_0R_JUMPER; Case: 0402; Mounted: Yes; Socket: No; SMD: Yes; Manufacturer1 Example: YAGEO PHYCOMP; Manufacturer1 ComponentHeight: 0.4mm; HelpURL: \\cern.ch\dfs\Applications\Altium\Datasheets\R0402_Phycomp_RC0402.pdf; Author: CERN DEM JLC; CreateDate: 2007-12-03; LatestRevisionDate: 2012-10-17
R308 R309 = R0402_100K_1%_0.0625W_100PPM: Resistor - 1%; Part Description: General Purpose Thick Film Chip Resistor; Manufacturer: GENERIC; Manufacturer1 Part Number: 232270671004L; TC: ±100ppm/°C; Table: Resistors SMD; Part Number: R0402_100K_1%_0.0625W_100PPM; Component Kind: Standard; Component Type: Standard; Pin Count: 2; Value: 100k; Status: Not recommended; Power: 0.0625W; Tolerance: ±1%; Manufacturer Part Number: R0402_100K_1%_0.0625W_100PPM; Case: 0402; Mounted: Yes; Socket: No; SMD: Yes; Manufacturer1 Example: YAGEO PHYCOMP; Manufacturer1 ComponentHeight: 0.4mm; HelpURL: \\cern.ch\dfs\Applications\Altium\Datasheets\R0402_Phycomp_RC0402.pdf; Author: CERN DEM JLC; CreateDate: 2007-12-03; LatestRevisionDate: 2012-10-17